# EAGLE design STM32_10FSR (EAGLE 9.5.2)
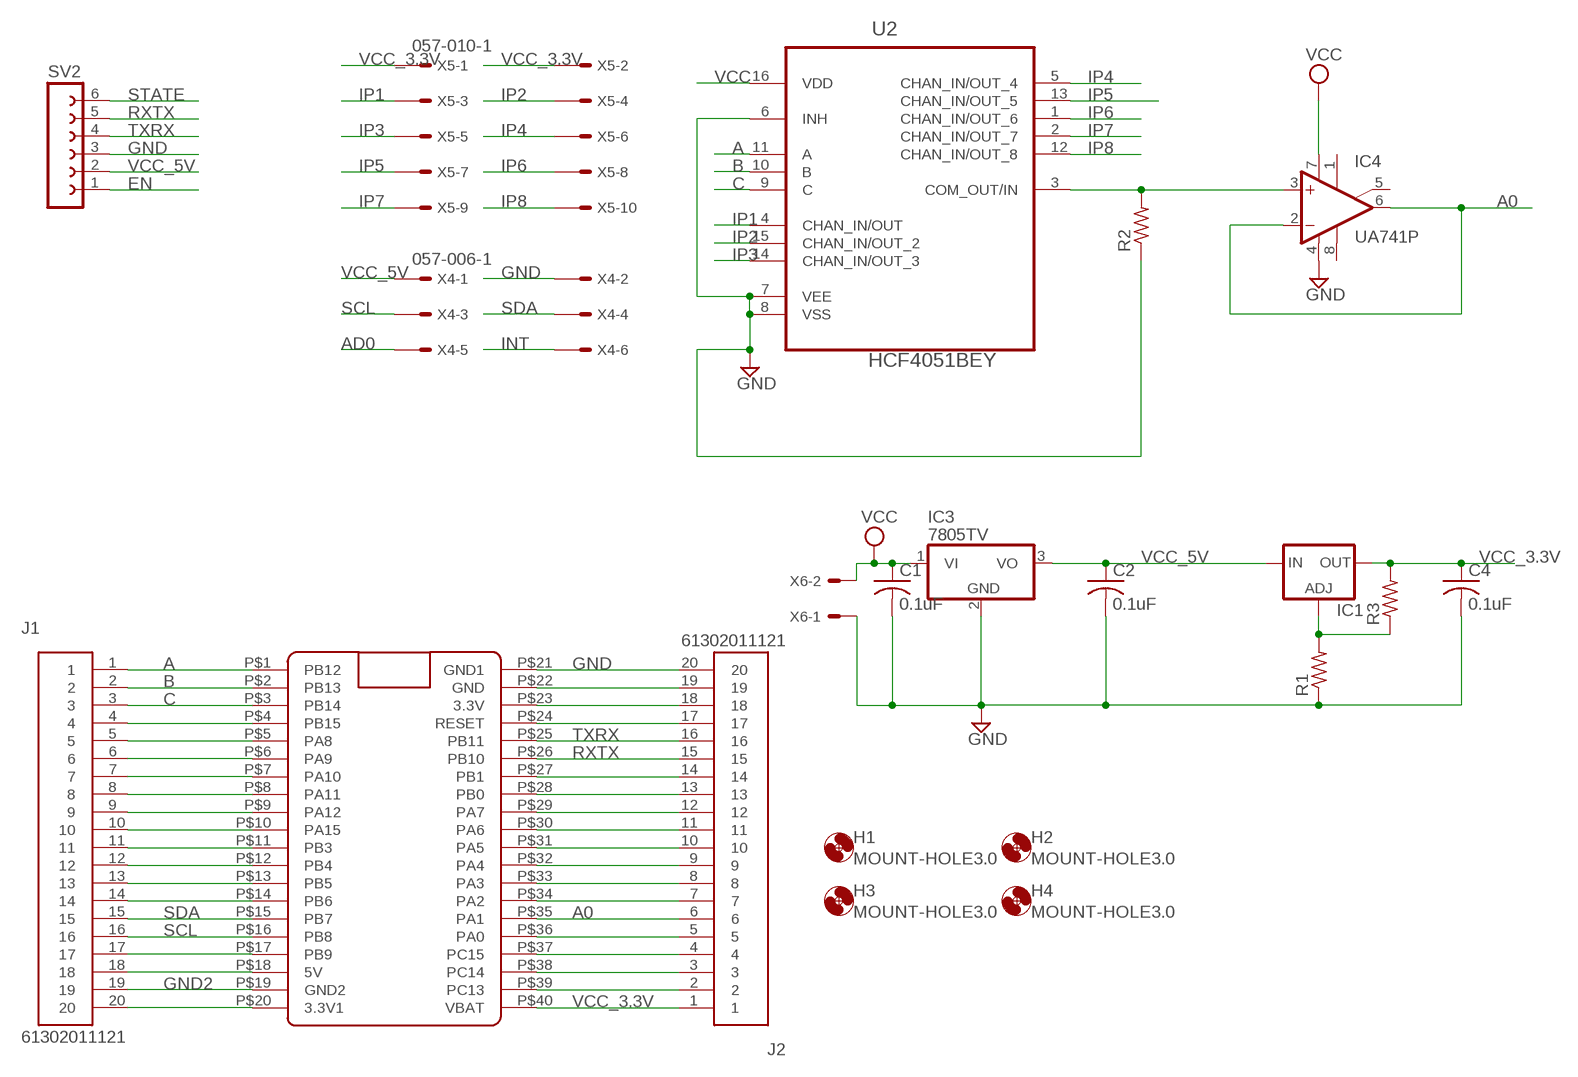
[diagram p0: schematic, sheet 1]

## Parts
C1  0.1uF  C-US025-024X044  [C025-024X044]
C2  0.1uF  C-US025-024X044  [C025-024X044]
C4  0.1uF  C-US025-024X044  [C025-024X044]
H1  MOUNT-HOLE3.0  [3,0]
H2  MOUNT-HOLE3.0  [3,0]
H3  MOUNT-HOLE3.0  [3,0]
H4  MOUNT-HOLE3.0  [3,0]
IC1  LM317TS  [317TS]
IC3  7805TV  [TO220V]
IC4  UA741P  [DIL08]
J1  61302011121  [61302011121]
J2  61302011121  [61302011121]
R1  R-US_0204/7  [0204/7]
R2  R-US_0204/7  [0204/7]
R3  R-US_0204/7  [0204/7]
SV2  FE06-1  [FE06]
U2  HCF4051BEY  [DIP254P762X510-16]
U$1  BLUE_PILLADVANCED  [BLUE_PILL_ADV]
X4  057-006-1  [057-006-1]
X5  057-010-1  [057-010-1]
X6  KK-156-2  [KK-156-2]

## Nets
A: J1.1 U2.11(A) U$1.P$1(PB12)
A0: IC4.2(-IN) IC4.6(OUT) J2.6 U$1.P$35(PA1)
AD0: X4.5
B: J1.2 U2.10(B) U$1.P$2(PB13)
C: J1.3 U2.9(C) U$1.P$3(PB14)
EN: SV2.1
GND: C1.2 C2.2 C4.2 IC3.2(GND) IC4.4(V-) J2.20 R1.1 R2.1 SV2.3 U2.6(INH) U2.7(VEE) U2.8(VSS) U$1.P$21(GND1) X4.2 X6.1
GND2: J1.19 U$1.P$19(GND2)
INT: X4.6
IP1: U2.4(CHAN_IN/OUT) X5.3
IP2: U2.15(CHAN_IN/OUT_2) X5.4
IP3: U2.14(CHAN_IN/OUT_3) X5.5
IP4: U2.5(CHAN_IN/OUT_4) X5.6
IP5: U2.13(CHAN_IN/OUT_5) X5.7
IP6: U2.1(CHAN_IN/OUT_6) X5.8
IP7: U2.2(CHAN_IN/OUT_7) X5.9
IP8: U2.12(CHAN_IN/OUT_8) X5.10
N$1: J1.6 U$1.P$6(PA9)
N$2: J1.7 U$1.P$7(PA10)
N$3: J2.5 U$1.P$36(PA0)
N$4: J1.4 U$1.P$4(PB15)
N$5: J1.5 U$1.P$5(PA8)
N$8: J1.8 U$1.P$8(PA11)
N$9: J1.9 U$1.P$9(PA12)
N$10: J1.10 U$1.P$10(PA15)
N$11: J1.11 U$1.P$11(PB3)
N$12: J1.12 U$1.P$12(PB4)
N$13: J1.13 U$1.P$13(PB5)
N$14: J1.14 U$1.P$14(PB6)
N$17: J1.17 U$1.P$17(PB9)
N$18: J1.18 U$1.P$18(5V)
N$20: J1.20 U$1.P$20(3.3V1)
N$21: IC1.1(ADJ) R1.2 R3.1
N$22: J2.2 U$1.P$39(PC13)
N$23: J2.3 U$1.P$38(PC14)
N$24: J2.4 U$1.P$37(PC15)
N$27: J2.7 U$1.P$34(PA2)
N$28: J2.8 U$1.P$33(PA3)
N$29: J2.9 U$1.P$32(PA4)
N$30: J2.10 U$1.P$31(PA5)
N$31: J2.11 U$1.P$30(PA6)
N$32: J2.12 U$1.P$29(PA7)
N$33: J2.13 U$1.P$28(PB0)
N$34: J2.14 U$1.P$27(PB1)
N$37: J2.17 U$1.P$24(RESET)
N$38: J2.18 U$1.P$23(3.3V)
N$39: J2.19 U$1.P$22(GND)
N$60: IC4.3(+IN) R2.2 U2.3(COM_OUT/IN)
RXTX: J2.15 SV2.5 U$1.P$26(PB10)
SCL: J1.16 U$1.P$16(PB8) X4.3
SDA: J1.15 U$1.P$15(PB7) X4.4
STATE: SV2.6
TXRX: J2.16 SV2.4 U$1.P$25(PB11)
VCC: C1.1 IC3.1(VI) IC4.7(V+) U2.16(VDD) X6.2
VCC_3.3V: C4.1 IC1.2(OUT) J2.1 R3.2 U$1.P$40(VBAT) X5.1 X5.2
VCC_5V: C2.1 IC1.3(IN) IC3.3(VO) SV2.2 X4.1
Unconnected: IC4.1(ON1) IC4.5(ON2) IC4.8(OPT)

## Library data of the parts
C1 C2 C4 = rcl:C-US: CAPACITOR, American symbol; SPICEPREFIX: C
H1-H4 = holes:MOUNT-HOLE: MOUNTING HOLE with drill center marker
IC1 = v-reg:LM317TS: VOLTAGE REGULATOR
IC3 = linear:78*: Positive VOLTAGE REGULATOR Source: http://cache.national.com/ds/LM/LM78L05.pdf http://www.fairchildsemi.com/ds/LM/LM7805.pdf
IC4 = linear:*741: OP AMP
J1 J2 = Headers:61302011121: CONN HEADER VERT 20POS 2.54MM Manufacturer's datasheet <https://katalog.we-online.de/em/datasheet/6130xx11121.pdf>; CREATED_BY: PCBLayout.com; DIGIKEY_PART_NUMBER: 732-5329-ND; MANUFACTURER: Wurth Electronics Inc.; MPN: 61302011121
R1-R3 = rcl:R-US_: RESISTOR, American symbol; SPICEPREFIX: R
SV2 = con-lsta:FE06-1: FEMALE HEADER; OC_FARNELL: unknown; OC_NEWARK: unknown
U2 = HCF4051BEY:HCF4051BEY: ANALOG MULTIPLEXER/DEMULTIPLEXER; AVAILABILITY: Unavailable; DESCRIPTION: 1 Circuit IC Switch 8:1 280Ohm 16-PDIP; MF: STMicroelectronics; MP: HCF4051BEY; PACKAGE: DIP-16 STMicroelectronics; PRICE: None
U$1 = BluePill:BLUE_PILL
X4 = con-panduit:057-006-: CONNECTOR 6-pin series 057 contact pc board low profile headers; OC_FARNELL: unknown; OC_NEWARK: unknown
X5 = con-panduit:057-010-: CONNECTOR 10-pin series 057 contact pc board low profile headers; OC_FARNELL: unknown; OC_NEWARK: unknown
X6 = con-molex:KK-156-2: KK 156 HEADER Source: http://www.molex.com/pdm_docs/sd/026604100_sd.pdf; MF: MOLEX; OC_FARNELL: unknown; OC_NEWARK: unknown

## Board
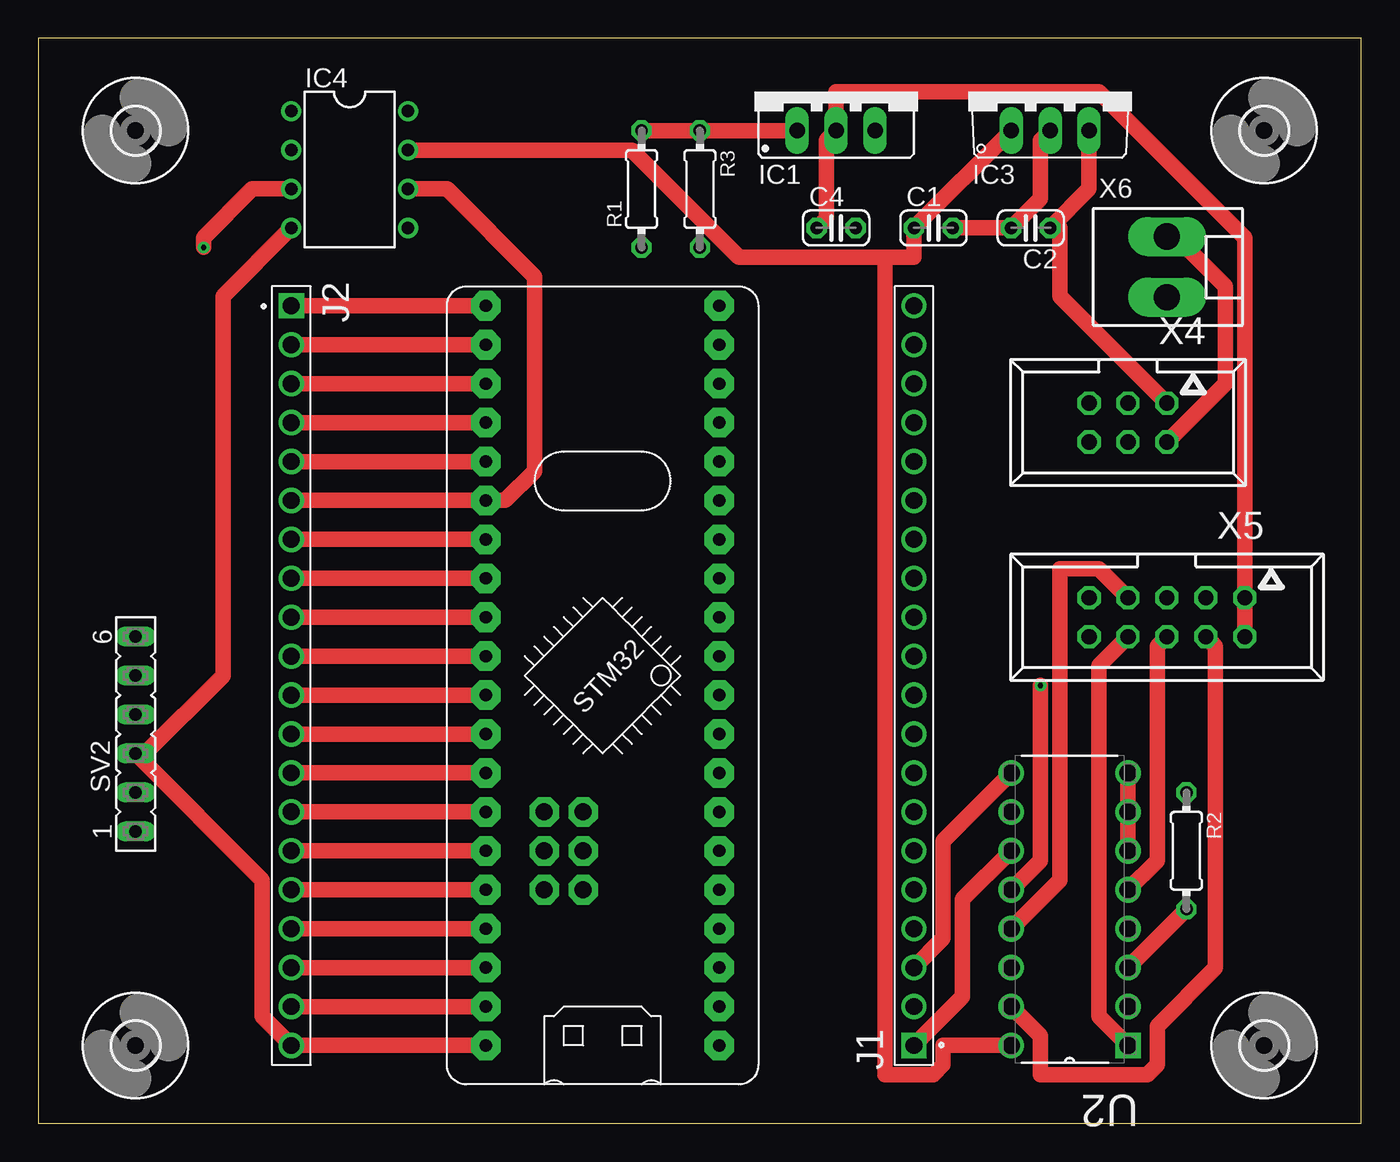
[diagram p1: board, top side]
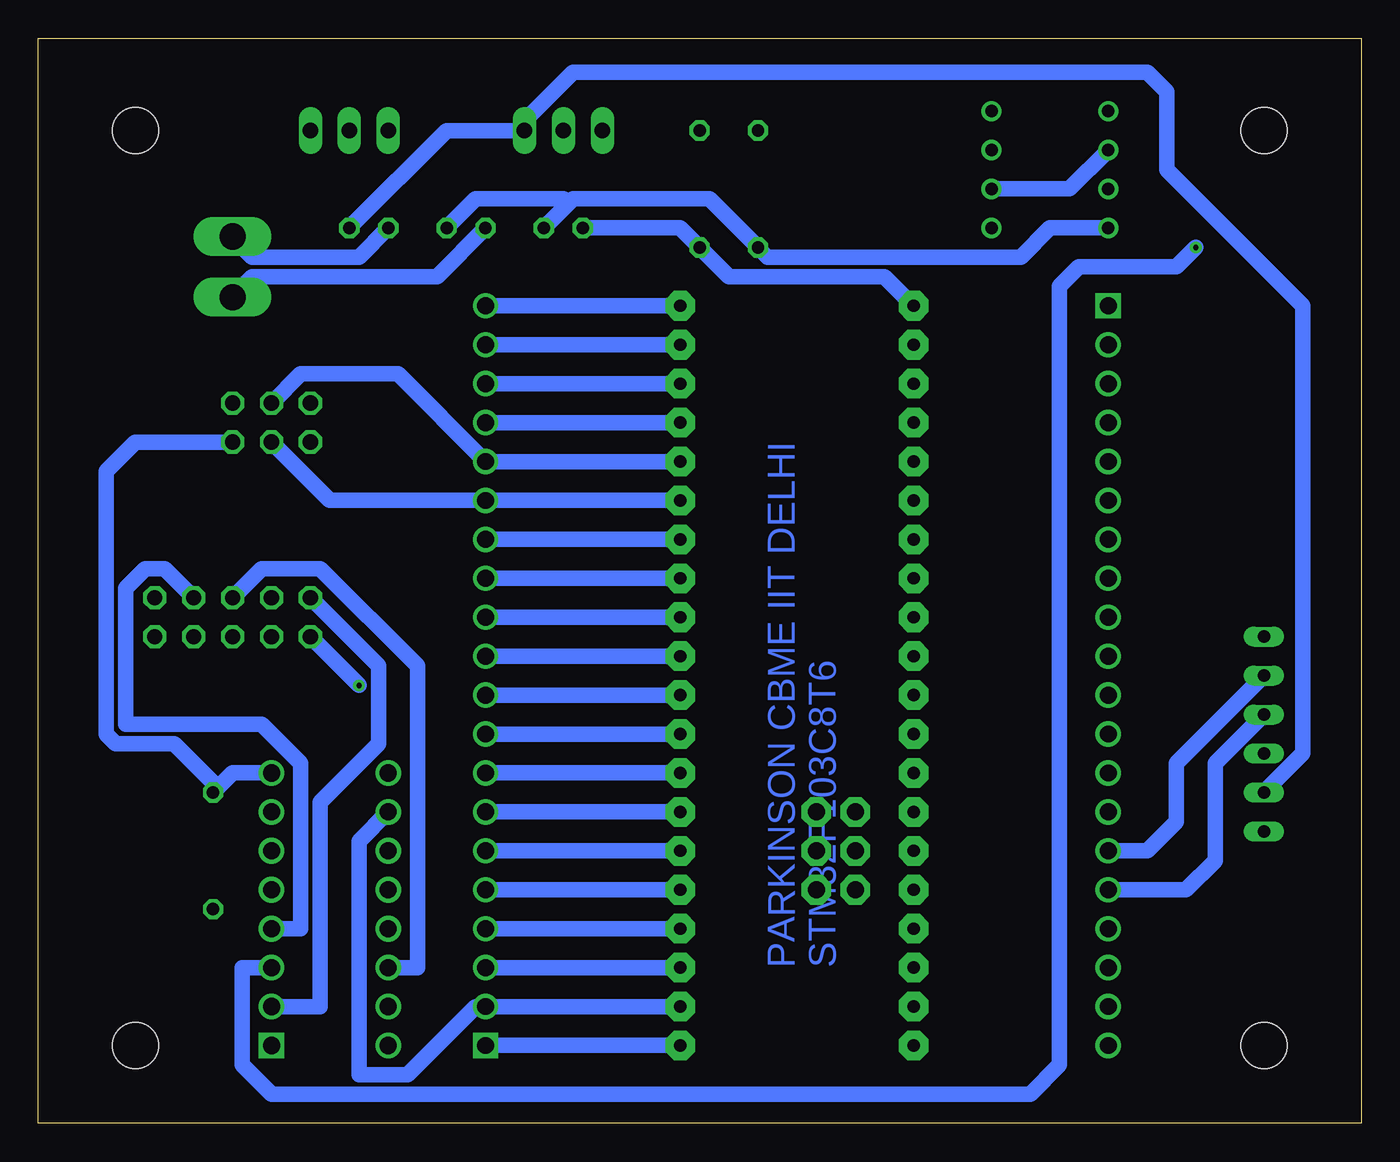
[diagram p2: board, bottom side, seen from below]

Size 86.34 x 70.79 mm. Coordinates in mm from the lower left corner, seen from the top.
Outline: 0,0 86.34,0 86.34,70.79 0,70.79 0,0
Copper layers (1*16): Top 0.035mm / dielectric 1.5mm / Bottom 0.035mm
Design rules "default *": minimum track width 40mil, minimum drill 0.35mm, track to track 6mil, track to pad 6mil, pad to pad 6mil, via to via 6mil, smd to smd 6mil, copper to edge 40mil, drill to drill 6mil, minimum pad ring 10mil, minimum via ring 8mil, stop-mask expansion 4mil, vias tented up to drill 0mil, thermal gap 10mil

### Footprints (pad centres in the part's own frame; a part is rotated, then mirrored left to right if it is on the bottom)
C025-024X044 = drill 0.813 octagon: 1 -1.27,0; 2 1.27,0
3,0 = hole 3: 0,0
317TS = drill 1.016 long: 1 -2.54,-2.54; 2 0,-2.54; 3 2.54,-2.54
TO220V = drill 1.016 long: 1 -2.54,-2.54; 2 0,-2.54; 3 2.54,-2.54
DIL08 = drill 0.813 pad 1.27: 1 -3.81,-3.81; 2 -1.27,-3.81; 3 1.27,-3.81; 4 3.81,-3.81; 5 3.81,3.81; 6 1.27,3.81; 7 -1.27,3.81; 8 -3.81,3.81
61302011121 = drill 1.1 square: 1 -24.13,0 | drill 1.1: 2 -21.59,0; 3 -19.05,0; 4 -16.51,0; 5 -13.97,0; 6 -11.43,0; 7 -8.89,0; 8 -6.35,0; 9 -3.81,0; 10 -1.27,0; 11 1.27,0; 12 3.81,0; 13 6.35,0; 14 8.89,0; 15 11.43,0; 16 13.97,0; 17 16.51,0; 18 19.05,0; 19 21.59,0; 20 24.13,0
0204/7 = drill 0.813 octagon: 1 -3.81,0; 2 3.81,0
FE06 = drill 0.813 long: 1 -6.35,0; 2 -3.81,0; 3 -1.27,0; 4 1.27,0; 5 3.81,0; 6 6.35,0
DIP254P762X510-16 = drill 1.118 square: 1 -7.62,17.78 | drill 1.118: 2 -7.62,15.24; 3 -7.62,12.7; 4 -7.62,10.16; 5 -7.62,7.62; 6 -7.62,5.08; 7 -7.62,2.54; 8 -7.62,0; 9 0,0; 10 0,2.54; 11 0,5.08; 12 0,7.62; 13 0,10.16; 14 0,12.7; 15 0,15.24; 16 0,17.78
BLUE_PILL_ADV = drill 0.8 pad 1.93 octagon: P$1 10.16,-30.48; P$2 10.16,-27.94; P$3 10.16,-25.4; P$4 10.16,-22.86; P$5 10.16,-20.32; P$6 10.16,-17.78; P$7 10.16,-15.24; P$8 10.16,-12.7; P$9 10.16,-10.16; P$10 10.16,-7.62; P$11 10.16,-5.08; P$12 10.16,-2.54; P$13 10.16,0; P$14 10.16,2.54; P$15 10.16,5.08; P$16 10.16,7.62; P$17 10.16,10.16; P$18 10.16,12.7; P$19 10.16,15.24; P$20 10.16,17.78; P$21 -5.08,-30.48; P$22 -5.08,-27.94; P$23 -5.08,-25.4; P$24 -5.08,-22.86; P$25 -5.08,-20.32; P$26 -5.08,-17.78; P$27 -5.08,-15.24; P$28 -5.08,-12.7; P$29 -5.08,-10.16; P$30 -5.08,-7.62; P$31 -5.08,-5.08; P$32 -5.08,-2.54; P$33 -5.08,0; P$34 -5.08,2.54; P$35 -5.08,5.08; P$36 -5.08,7.62; P$37 -5.08,10.16; P$38 -5.08,12.7; P$39 -5.08,15.24; P$40 -5.08,17.78 | drill 1.1 pad 1.93 octagon: P$42 -1.27,-20.32; P$43 -1.27,-17.78; P$44 -1.27,-15.24; P$45 1.27,-15.24; P$46 1.27,-17.78; P$47 1.27,-20.32
057-006-1 = drill 1 octagon: 1 -2.54,-1.27; 2 -2.54,1.27; 3 0,-1.27; 4 0,1.27; 5 2.54,-1.27; 6 2.54,1.27
057-010-1 = drill 1 octagon: 1 -5.08,-1.27; 2 -5.08,1.27; 3 -2.54,-1.27; 4 -2.54,1.27; 5 0,-1.27; 6 0,1.27; 7 2.54,-1.27; 8 2.54,1.27; 9 5.08,-1.27; 10 5.08,1.27
KK-156-2 = drill 1.7 pad 2.184 long: 1 -1.98,0; 2 1.98,0

### Placement (x,y rotation side)
C1  58.42,58.42 0 top
C2  64.77,58.42 180 top
C4  52.07,58.42 0 top
H1  6.35,5.08 0 top
H2  6.35,64.77 0 top
H3  80.01,5.08 0 top
H4  80.01,64.77 0 top
IC1  52.07,67.31 0 top
IC3  66.04,67.31 0 top
IC4  20.32,62.23 270 top
J1  57.15,29.21 90 top
J2  16.51,29.21 270 top
R1  39.37,60.96 90 top
R2  74.93,17.78 270 top
R3  43.18,60.96 270 top
SV2  6.35,25.4 90 top
U2  63.5,22.86 180 top
U$1  34.29,35.56 0 top
X4  71.12,45.72 180 top
X5  73.66,33.02 180 top
X6  73.66,55.88 270 top

### Tracks (layer width: path | path; a pad name or v marks a point on that pad's centre or on a via)
A
  Top 1.016: U2.11 60.33,14.61 60.33,8.26 J1.1
  Bottom 1.016: U$1.P$1 J1.1
A0
  Top 1.016: IC4.6 26.67,60.96 32.38,55.24 32.38,42.55 30.48,40.64 U$1.P$35 J2.6
  Bottom 1.016: IC4.2 19.05,60.96 IC4.6
B
  Bottom 1.016: U$1.P$2 J1.2 57.78,7.62 62.23,3.17 65.41,3.17 65.41,18.41 U2.10
C
  Top 1.016: U2.9 59.05,18.41 59.05,12.06 J1.3
  Bottom 1.016: U$1.P$3 J1.3
GND
  Top 1.016: U2.6 U2.7 U2.8 | X4.2 77.47,48.26 77.47,54.61 73.66,58.42 X6.1 | U$1.P$21 J2.20 14.61,6.99 14.61,15.88 SV2.3 6.99,24.13 12.06,29.21 12.06,53.98 IC4.4 | C1.2 C2.2 65.41,60.33 65.41,64.14 IC3.2
  Bottom 1.016: U2.8 73.66,22.86 R2.1 74.93,22.23 77.47,24.77 81.28,24.77 81.92,25.4 81.92,42.55 80.01,44.45 X4.2 | C4.2 51.75,60.01 | 51.75,60.01 51.44,60.33 42.55,60.33 R1.1 38.73,56.52 22.23,56.52 20.32,58.42 IC4.4 | C1.2 57.78,60.33 52.07,60.33 51.75,60.01 | C2.2 65.41,56.52 72.39,56.52 73.66,57.78 X6.1
GND2
  Bottom 1.016: U$1.P$19 J1.19
IP1
  Bottom 1.016: X5.3 78.11,36.2 79.38,36.2 80.64,34.92 80.64,26.04 71.75,26.04 69.22,23.5 69.22,12.7 U2.4
IP2
  Top 1.016: X5.4 76.83,31.11 76.83,10.16 73.03,6.35 73.03,3.81 72.39,3.17 65.41,3.17 65.41,5.71 U2.15
IP3
  Bottom 1.016: X5.5 71.75,36.2 67.94,36.2 61.59,29.84 61.59,10.16 U2.14
IP4
  Top 1.016: X5.6 73.03,31.11 73.03,17.14 U2.5
IP5
  Top 1.016: X5.7 69.22,36.2 66.67,36.2 66.67,15.88 U2.13
IP6
  Top 1.016: X5.8 69.22,29.84 69.22,6.99 U2.1
IP7
  Bottom 1.016: X5.9 64.14,29.84 64.14,24.77 67.94,20.95 67.94,7.62 U2.2
IP8  (via drill 0.35)
  Top 1.016: v65.41,28.57 65.41,17.14 U2.12
  Bottom 1.016: v65.41,28.57 X5.10
N$1
  Bottom 1.016: U$1.P$6 J1.6
N$2
  Bottom 1.016: U$1.P$7 J1.7
N$3
  Top 1.016: J2.5 U$1.P$36
N$4
  Bottom 1.016: U$1.P$4 J1.4
N$5
  Bottom 1.016: U$1.P$5 J1.5
N$8
  Bottom 1.016: U$1.P$8 J1.8
N$9
  Bottom 1.016: U$1.P$9 J1.9
N$10
  Bottom 1.016: U$1.P$10 J1.10
N$11
  Bottom 1.016: U$1.P$11 J1.11
N$12
  Bottom 1.016: U$1.P$12 J1.12
N$13
  Bottom 1.016: U$1.P$13 J1.13
N$14
  Bottom 1.016: U$1.P$14 J1.14
N$17
  Bottom 1.016: U$1.P$17 J1.17
N$18
  Bottom 1.016: U$1.P$18 J1.18
N$20
  Bottom 1.016: U$1.P$20 J1.20
N$21
  Top 1.016: R1.2 R3.1 IC1.1
N$22
  Top 1.016: U$1.P$39 J2.2
N$23
  Top 1.016: U$1.P$38 J2.3
N$24
  Top 1.016: U$1.P$37 J2.4
N$27
  Top 1.016: U$1.P$34 J2.7
N$28
  Top 1.016: U$1.P$33 J2.8
N$29
  Top 1.016: U$1.P$32 J2.9
N$30
  Top 1.016: U$1.P$31 J2.10
N$31
  Top 1.016: U$1.P$30 J2.11
N$32
  Top 1.016: U$1.P$29 J2.12
N$33
  Top 1.016: U$1.P$28 J2.13
N$34
  Top 1.016: U$1.P$27 J2.14
N$37
  Top 1.016: U$1.P$24 J2.17
N$38
  Top 1.016: U$1.P$23 J2.18
N$39
  Top 1.016: U$1.P$22 J2.19
N$60  (via drill 0.35)
  Top 1.016: IC4.3 13.97,60.96 10.79,57.78 v10.79,57.15 | U2.3 R2.2
  Bottom 1.016: v10.79,57.15 12.06,55.88 18.41,55.88 19.68,54.61 19.68,3.81 21.59,1.91 71.12,1.91 73.03,3.81 73.03,10.16 U2.3
RXTX
  Top 1.016: J2.15 U$1.P$26
  Bottom 1.016: SV2.5 12.06,23.5 12.06,19.68 13.97,17.78 J2.15
SCL
  Bottom 1.016: X4.3 69.22,48.9 62.87,48.9 J1.16 U$1.P$16
SDA
  Bottom 1.016: X4.4 67.31,40.64 J1.15 U$1.P$15
TXRX
  Top 1.016: J2.16 U$1.P$25
  Bottom 1.016: SV2.4 9.53,23.5 9.53,17.14 11.43,15.24 J2.16
VCC
  Top 1.016: IC3.1 C1.1 57.15,56.52 55.24,56.52 | IC4.7 38.73,63.5 45.72,56.52 55.24,56.52 | U2.16 59.05,5.08 59.05,3.81 58.42,3.17 55.24,3.17 55.24,56.52
  Bottom 1.016: C1.1 60.33,55.24 72.39,55.24 73.66,53.98 X6.2
VCC_3.3V
  Top 1.016: U$1.P$40 J2.1 | X5.2 X5.1 78.74,57.78 69.22,67.31 52.07,67.31 IC1.2 51.44,64.14 51.44,59.05 C4.1
  Bottom 1.016: C4.1 44.45,58.42 R3.2 41.27,55.24 31.11,55.24 U$1.P$40
VCC_5V
  Top 1.016: IC3.3 68.58,60.96 C2.1 66.67,58.42 66.67,53.98 X4.1
  Bottom 1.016: SV2.2 3.81,24.13 3.81,53.34 12.7,62.23 12.7,67.31 13.97,68.58 51.44,68.58 54.61,65.41 IC1.3 59.69,64.77 C2.1

### Text on the board
Bottom: PARKINSON CBME IIT DELHI / STM32F103C8T6